# Altium schematic sheet Display.SchDoc
size B; Organization: Mechanart, LLC; Address1: 397 Laurie Meadows Drive; Address2: Apt. 437; Address3: San Mateo, CA 94403
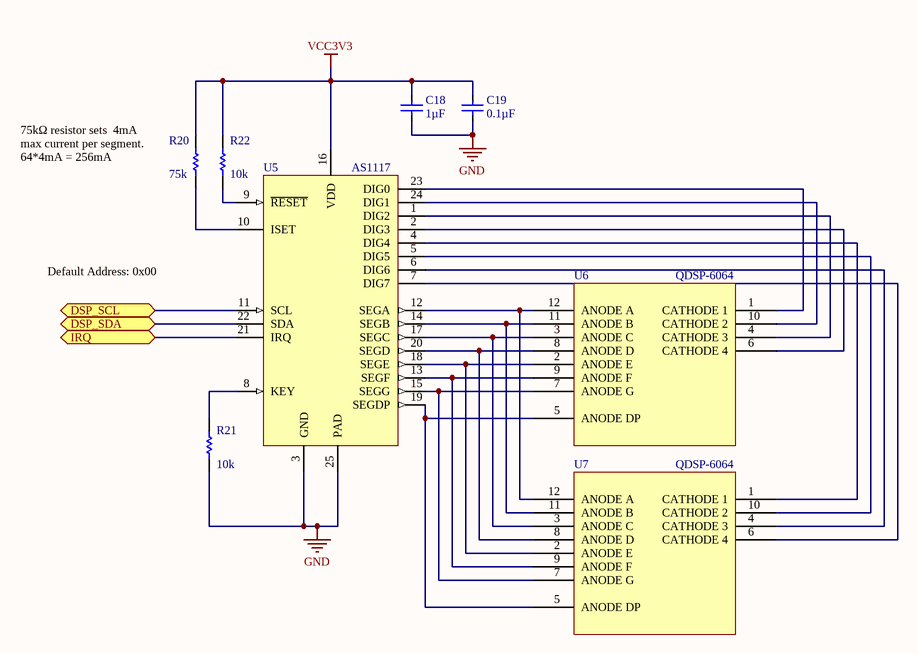
[diagram p0: Display.SchDoc]

## Parts
C18  1µF  [CAPC1005X50L25N]
C19  0.1µF  [CAPC1005X50L25N]
R20  75k  [RESC1005X40L25N]
R21  10k  [RESC1005X40L25N]
R22  10k  [RESC1005X40L25N]
U5  AS1117  [PQFN50P400X400X60-25T290X290L]
U6  QDSP-6064  [DIP762W51P254L1537H483Q12_SMT]
U7  QDSP-6064  [DIP762W51P254L1537H483Q12_SMT]

## Ports
DSP_SCL, DSP_SDA, IRQ

## Nets
GND: C18.2 C19.2 R21.1 U5.3(GND) U5.25(PAD)
VCC3V3: C18.1 C19.1 R20.2 R22.2 U5.16(VDD)
DSP_SCL: U5.11(SCL) ; port DSP_SCL
DSP_SDA: U5.22(SDA) ; port DSP_SDA
IRQ: U5.21(IRQ) ; port IRQ
NetR20_1: R20.1 U5.10(ISET)
NetR21_2: R21.2 U5.8(KEY)
NetR22_1: R22.1 U5.9(~{RESET})
NetU5_1: U5.1(DIG2) U6.4(CATHODE_3)
NetU5_2: U5.2(DIG3) U6.6(CATHODE_4)
NetU5_4: U5.4(DIG4) U7.1(CATHODE_1)
NetU5_5: U5.5(DIG5) U7.10(CATHODE_2)
NetU5_6: U5.6(DIG6) U7.4(CATHODE_3)
NetU5_7: U5.7(DIG7) U7.6(CATHODE_4)
NetU5_12: U5.12(SEGA) U6.12(ANODE_A) U7.12(ANODE_A)
NetU5_13: U5.13(SEGF) U6.9(ANODE_F) U7.9(ANODE_F)
NetU5_14: U5.14(SEGB) U6.11(ANODE_B) U7.11(ANODE_B)
NetU5_15: U5.15(SEGG) U6.7(ANODE_G) U7.7(ANODE_G)
NetU5_17: U5.17(SEGC) U6.3(ANODE_C) U7.3(ANODE_C)
NetU5_18: U5.18(SEGE) U6.2(ANODE_E) U7.2(ANODE_E)
NetU5_19: U5.19(SEGDP) U6.5(ANODE_DP) U7.5(ANODE_DP)
NetU5_20: U5.20(SEGD) U6.8(ANODE_D) U7.8(ANODE_D)
NetU5_23: U5.23(DIG0) U6.1(CATHODE_1)
NetU5_24: U5.24(DIG1) U6.10(CATHODE_2)

## Notes on the sheet
- (near R20) 75kΩ resistor sets  4mA max current per segment.
  64*4mA = 256mA
- Default Address: 0x00
- Title
- Size:
- Date:
- B
- Number:
- Time:
- Revision:
- Sheet
- of
- File:

## Library data of the parts
C18 = GRM155R70J105KA12D: CAP CER 1UF 6.3V X7R 0402; Manufacturer: Murata Electronics North America; Tolerance: ±10%; Design Item Id: GRM155R70J105KA12D; Supplier 1: Digi-Key; Supplier Part Number 1: 490-10024-1-ND; Manufacturer Part Number: GRM155R70J105KA12D; RoHS: RoHS Compliant; Category: Capacitors; Stock 1: 26230; Pricing 1: 1=0.1, 10=0.076, 50=0.041, 100=0.0347, 250=0.02836, 500=0.02426, 1000=0.0189, 5000=0.01575 (USD); Packaging: Cut Tape (CT); Applications: General Purpose; Operating Temperature: -55°C ~ 125°C; Mounting Type: Surface Mount, MLCC; Package / Case: 0402 (1005 Metric); ComponentLink1URL: http://www.murata.com/~/media/webrenewal/support/library/catalog/products/capacitor/mlcc/c02e.ashx; ComponentLink1Description: http://www.murata.com/~/media/webrenewal/support/library/catalog/products/capacitor/mlcc/c02e.ashx; Capacitance: 1µF; Voltage - Rated: 6.3V; Temperature Coefficient: X7R; Ratings: -; Size / Dimension: 0.039" L x 0.020" W (1.00mm x 0.50mm); Height - Seated (Max): -; Thickness (Max): 0.022" (0.55mm); Lead Spacing: -; Features: Derating Recommended; Lead Style: -
C19 = GRM155R71H104KE14D: CAP CER 0.1UF 50V X7R 0402; Manufacturer: Murata Electronics North America; Tolerance: ±10%; Design Item Id: GRM155R71H104KE14D; Supplier 1: Digi-Key; Supplier Part Number 1: 490-10700-1-ND; Manufacturer Part Number: GRM155R71H104KE14D; RoHS: RoHS Compliant; Category: Capacitors; Stock 1: 28600; Pricing 1: 1=0.1, 10=0.029, 50=0.0156, 100=0.0132, 250=0.0108, 500=0.00924, 1000=0.0072, 5000=0.006 (USD); Packaging: Cut Tape (CT); Applications: General Purpose; Operating Temperature: -55°C ~ 125°C; Mounting Type: Surface Mount, MLCC; Package / Case: 0402 (1005 Metric); ComponentLink1URL: http://www.murata.com/~/media/webrenewal/support/library/catalog/products/capacitor/mlcc/c02e.ashx; ComponentLink1Description: http://www.murata.com/~/media/webrenewal/support/library/catalog/products/capacitor/mlcc/c02e.ashx; Capacitance: 0.1µF; Voltage - Rated: 50V; Temperature Coefficient: X7R; Ratings: -; Size / Dimension: 0.039" L x 0.020" W (1.00mm x 0.50mm); Height - Seated (Max): -; Thickness (Max): 0.022" (0.55mm); Lead Spacing: -; Features: -; Lead Style: -
R20 = ERJ-2RKF7502X: RES SMD 75K OHM 1% 1/10W 0402; Manufacturer: Panasonic Electronic Components; Power (Watts): 0.1W, 1/10W; Temperature Coefficient: ±100ppm/°C; Design Item Id: ERJ-2RKF7502X; Resistance: 75k; Footprint: RESC_1005[0402]_N; Supplier 1: Digi-Key; Supplier Part Number 1: P75.0KLCT-ND; Manufacturer Part Number: ERJ-2RKF7502X; RoHS: RoHS Compliant; Category: Resistors; Stock 1: 235416; Pricing 1: 1=0.1, 50=0.015, 100=0.011, 250=0.0084, 500=0.00674, 1000=0.00496, 5000=0.00355 (USD); Packaging: Cut Tape (CT); Operating Temperature: -55°C ~ 155°C; Package / Case: 0402 (1005 Metric); Supplier Device Package: 0402; ComponentLink1URL: http://industrial.panasonic.com/www-cgi/jvcr13pz.cgi?E+PZ+3+AOA0002+ERJ2RKF7502X+7+WW; ComponentLink1Description: http://industrial.panasonic.com/www-cgi/jvcr13pz.cgi?E+PZ+3+AOA0002+ERJ2RKF7502X+7+WW; Tolerance: ±1%; Composition: Thick Film; Features: Automotive AEC-Q200; Size / Dimension: 0.039" L x 0.020" W (1.00mm x 0.50mm); Height: 0.016" (0.40mm); Number of Terminations: 2
R21 R22 = CRCW040210K0JNED: RES SMD 10K OHM 5% 1/16W 0402; Manufacturer: Vishay Dale; Power (Watts): 0.063W, 1/16W; Temperature Coefficient: ±200ppm/°C; Design Item Id: CRCW040210K0JNED; Resistance: 10k; Footprint: RESC_1005[0402]_N; Supplier 1: Digi-Key; Supplier Part Number 1: 541-10KJCT-ND; Manufacturer Part Number: CRCW040210K0JNED; RoHS: RoHS Compliant; Category: Resistors; Stock 1: 446077; Pricing 1: 10=0.074, 50=0.04, 200=0.02295, 1000=0.01566 (USD); Packaging: Cut Tape (CT); Operating Temperature: -55°C ~ 155°C; Package / Case: 0402 (1005 Metric); Supplier Device Package: 0402 (1005 Metric); ComponentLink1URL: http://www.vishay.com/docs/20035/dcrcwe3.pdf; ComponentLink1Description: http://www.vishay.com/docs/20035/dcrcwe3.pdf; Tolerance: ±5%; Composition: Thick Film; Features: Automotive AEC-Q200; Size / Dimension: 0.039" L x 0.020" W (1.00mm x 0.50mm); Height: 0.016" (0.40mm); Number of Terminations: 2
U5 = AS1117-BQFT: IC DRIVER 64LED MOBILE 24-TQFN; Manufacturer: ams; Current - Supply: 335mA; Voltage - Supply: 2.7 V ~ 5.5 V; Display Type: LED; Configuration: 8 x (7 Segment), 64 LED; Interface: I²C; Digits or Characters: 8 Digits; Design Item Id: AS1117-BQFT; Supplier 1: Digi-Key; Supplier Part Number 1: AS1117-BQFTCT-ND; Manufacturer Part Number: AS1117-BQFT; RoHS: RoHS Compliant; Category: Integrated Circuits (ICs); Stock 1: 662; Pricing 1: 1=4.23, 10=3.804, 25=3.452, 100=3.0997, 250=2.81792, 500=2.46566 (USD); Packaging: Cut Tape (CT); Operating Temperature: -40°C ~ 85°C; Mounting Type: Surface Mount; Package / Case: 24-UFQFN Exposed Pad; Supplier Device Package: 24-TQFN (4x4); ComponentLink1URL: http://www.ams.com/content/download/48343/529874/32295; ComponentLink1Description: http://www.ams.com/content/download/48343/529874/32295
U6 U7 = QDSP-6064: HP 4-Digit LED 7-Segment Bubble Display; Design Item Id: QDSP-6064; Supplier 1: Sparkfun; Supplier Part Number 1: COM-12710; Manufacturer: HP; Manufacturer Part Number: QDSP-6064; Category: Display; Stock 1: 100; Pricing 1: 2.95; Packaging: 12-pin DIP